# EasyEDA Pro project 25工创PCB.eprj, schematic 灯光板原理图
Board Name: 灯光板; Create Date: 2025-02-26; Page Name: P1; Project Name: 25工创PCB; Schematic Name: 灯光板原理图; Update Date: 2025-02-27; Company: 嘉立创EDA; Page Size: A4; Version: V1.0
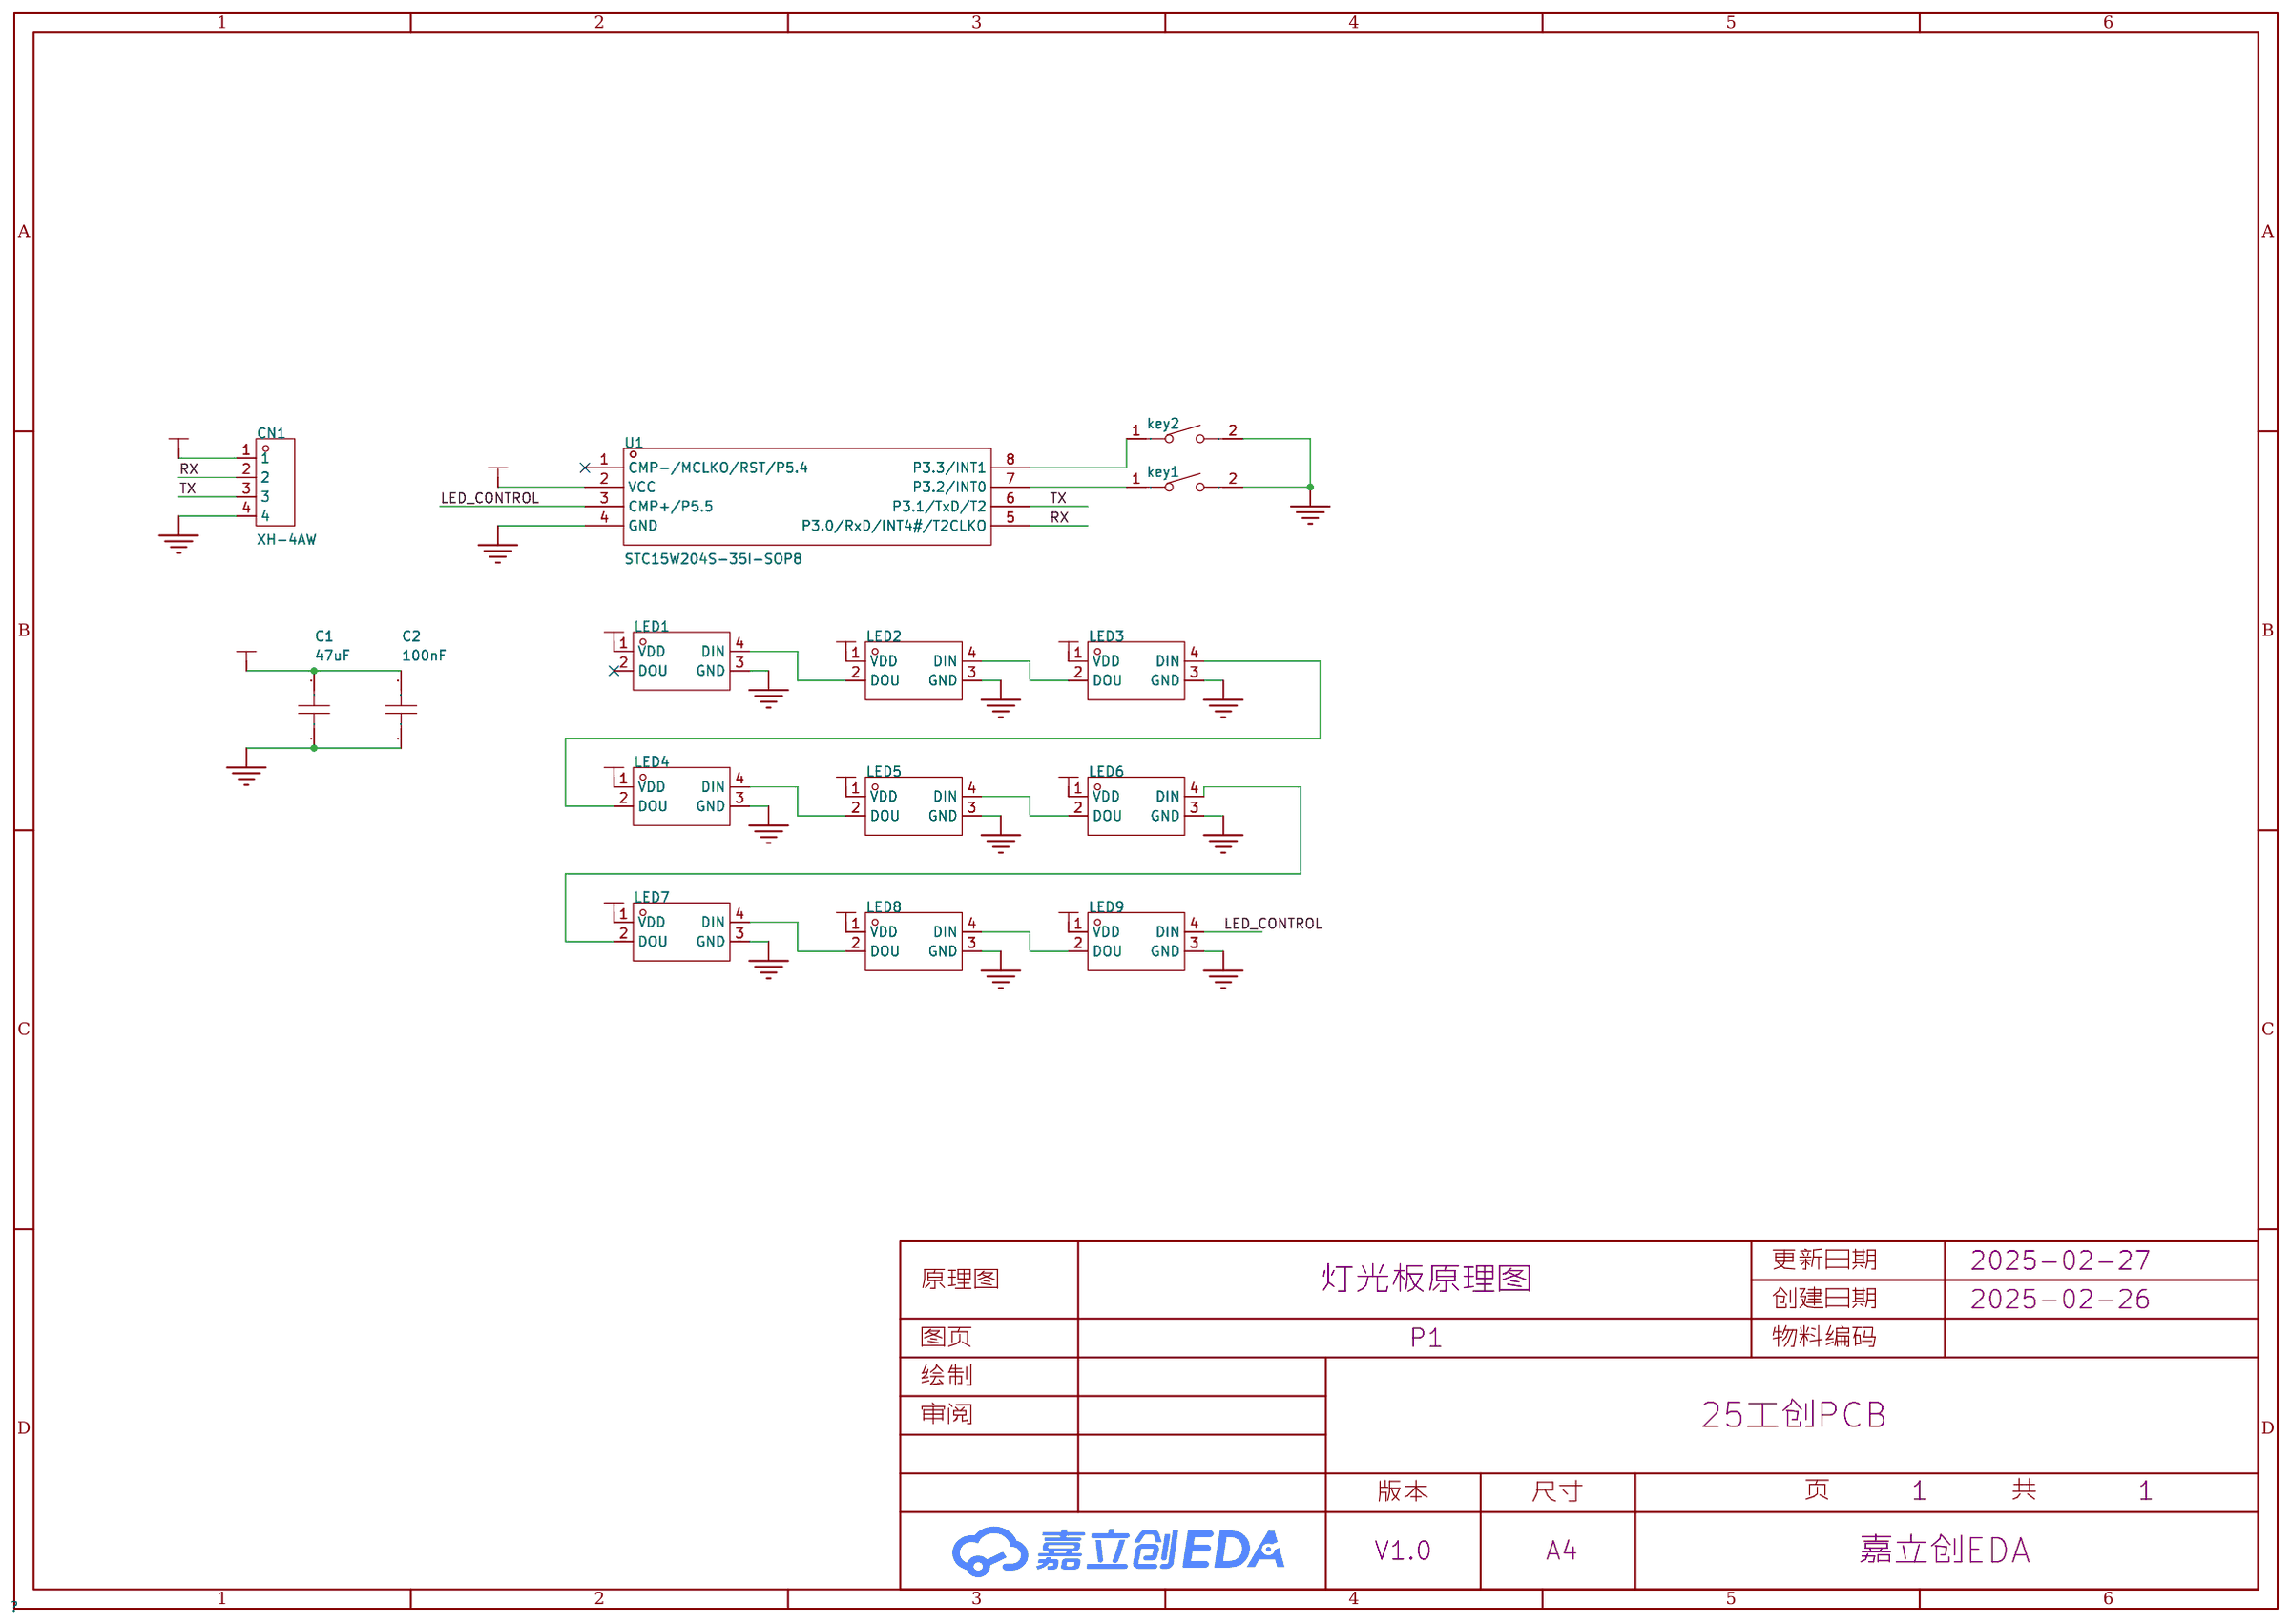
[diagram p4: schematic sheet]

## Parts
C1  47uF  [C0603]
C2  100nF  [C0603]
CN1  XH-4AW  [CONN-TH_XH-4AW]
key1  TS-1088-AR02016  [SW-SMD_L3.9-W3.0-P4.45]
key2  TS-1088-AR02016  [SW-SMD_L3.9-W3.0-P4.45]
LED1  XL-5050RGBC-WS2812B  [LED-SMD_4P-L5.0-W5.0-BL_XL-5050RGBC]
LED2  XL-5050RGBC-WS2812B  [LED-SMD_4P-L5.0-W5.0-BL_XL-5050RGBC]
LED3  XL-5050RGBC-WS2812B  [LED-SMD_4P-L5.0-W5.0-BL_XL-5050RGBC]
LED4  XL-5050RGBC-WS2812B  [LED-SMD_4P-L5.0-W5.0-BL_XL-5050RGBC]
LED5  XL-5050RGBC-WS2812B  [LED-SMD_4P-L5.0-W5.0-BL_XL-5050RGBC]
LED6  XL-5050RGBC-WS2812B  [LED-SMD_4P-L5.0-W5.0-BL_XL-5050RGBC]
LED7  XL-5050RGBC-WS2812B  [LED-SMD_4P-L5.0-W5.0-BL_XL-5050RGBC]
LED8  XL-5050RGBC-WS2812B  [LED-SMD_4P-L5.0-W5.0-BL_XL-5050RGBC]
LED9  XL-5050RGBC-WS2812B  [LED-SMD_4P-L5.0-W5.0-BL_XL-5050RGBC]
U1  STC15W204S-35I-SOP8  [SOP-8_L4.9-W3.9-P1.27-LS6.0-BL]

## Library data of the parts
C1 C2 = CAP_0603: Supplier Footprint: 0603
CN1 = XH-4AW: LCSC Part Name: 1x4P 间距:2.54mm 弯插 系列:XH; Supplier Part: C2908613; Manufacturer: HCTL(华灿天禄); Supplier Footprint: 弯插,P=2.5mm; JLCPCB Part Class: 扩展库; Datasheet: https://atta.szlcsc.com/upload/public/pdf/source/20230711/B565BAF3B11666EF6B81B3605408F2BD.pdf; Supplier: LCSC; Pins Structure: 1x4P; Pitch: 2.54mm; Mounting Style: 弯插; Reference Series: XH; Number of Pins: 4P; Number of Rows: 1; Number of PINs Per Row: 4; Current Rating (Max): 3A; Contact Material: 黄铜; Contact Plating: 锡; Operating Temperature Range: -25℃~+85℃
key1 key2 = TS-1088-AR02016: +POW; LCSC Part Name: 4*3*2mm 立贴 轻触开关; Supplier Part: C720477; Manufacturer: XUNPU(讯普); Supplier Footprint: SMD; JLCPCB Part Class: Extended Part; Datasheet: https://atta.szlcsc.com/upload/public/pdf/source/20200810/C720475_60D09DD6C54279ADDB2DC25100F1CC11.pdf; Supplier: LCSC; Contact Current: 50mA; Voltage Rating (DC): +POW; Insulation Resistance: 100MΩ; Circuit: 单刀单掷; Mounting Style: 立贴; Actuator Style: 圆形按钮; Actuator/Cap Color: 黑色; Operating Force: 160gf@±50gf; Mechanical Life: 10万次; Operating Temperature: -30~+80; Pin Style: SMD接片; Switch Length: 4mm; Switch Width: 3mm; Switch Height: 2mm; Strike Gundam: 否
LED1-LED9 = XL-5050RGBC-WS2812B: Supplier Part: C2843785; Manufacturer: XINGLIGHT(成兴光); Supplier Footprint: SMD5050; JLCPCB Part Class: 扩展库; Datasheet: https://atta.szlcsc.com/upload/public/pdf/source/20240412/E1004CAA80592E31D08BFE019083806F.pdf; Supplier: LCSC
U1 = STC15W204S-35I-SOP8: Supplier Part: C42240; Manufacturer: STC; Supplier Footprint: SOP-8; JLCPCB Part Class: 扩展库; Datasheet: https://atta.szlcsc.com/upload/public/pdf/source/20200306/C50712_CB7A0FE99BDE9A8F947079BEF15207A3.pdf; Supplier: LCSC; CPU Core: 51系列; Program Storage Size: 4KB; Program Memory Type: FLASH; Number of I/O: 6; Low Voltage Detection Threshold: 2.5V~5.5V

## Nets
5V: C1.2 C2.2 CN1.1 LED1.1(VDD) LED2.1(VDD) LED3.1(VDD) LED4.1(VDD) LED5.1(VDD) LED6.1(VDD) LED7.1(VDD) LED8.1(VDD) LED9.1(VDD) U1.2(VCC)
GND: C1.1 C2.1 CN1.4 key1.2 key2.2 LED1.3(GND) LED2.3(GND) LED3.3(GND) LED4.3(GND) LED5.3(GND) LED6.3(GND) LED7.3(GND) LED8.3(GND) LED9.3(GND) U1.4(GND)
LED_CONTROL: LED9.4(DIN) U1.3(CMP+/P5.5)
RX: CN1.2 U1.5(P3.0/RxD/INT4#/T2CLKO)
TX: CN1.3 U1.6(P3.1/TxD/T2)
$1N962: key1.1 U1.7(P3.2/INT0)
$1N966: key2.1 U1.8(P3.3/INT1)
$1N1827: LED1.4(DIN) LED2.2(DOU)
$1N1837: LED2.4(DIN) LED3.2(DOU)
$1N1844: LED3.4(DIN) LED4.2(DOU)
$1N1852: LED4.4(DIN) LED5.2(DOU)
$1N1862: LED5.4(DIN) LED6.2(DOU)
$1N1869: LED6.4(DIN) LED7.2(DOU)
$1N1881: LED7.4(DIN) LED8.2(DOU)
$1N1887: LED8.4(DIN) LED9.2(DOU)

Not connected (* = marked no-connect by the designer): LED1 2(DOU)*; U1 1(CMP-/MCLKO/RST/P5.4)*
